# EAGLE design PUSHBUTTON-DEBOUNCE-INTERFACE (EAGLE 6.5.0)
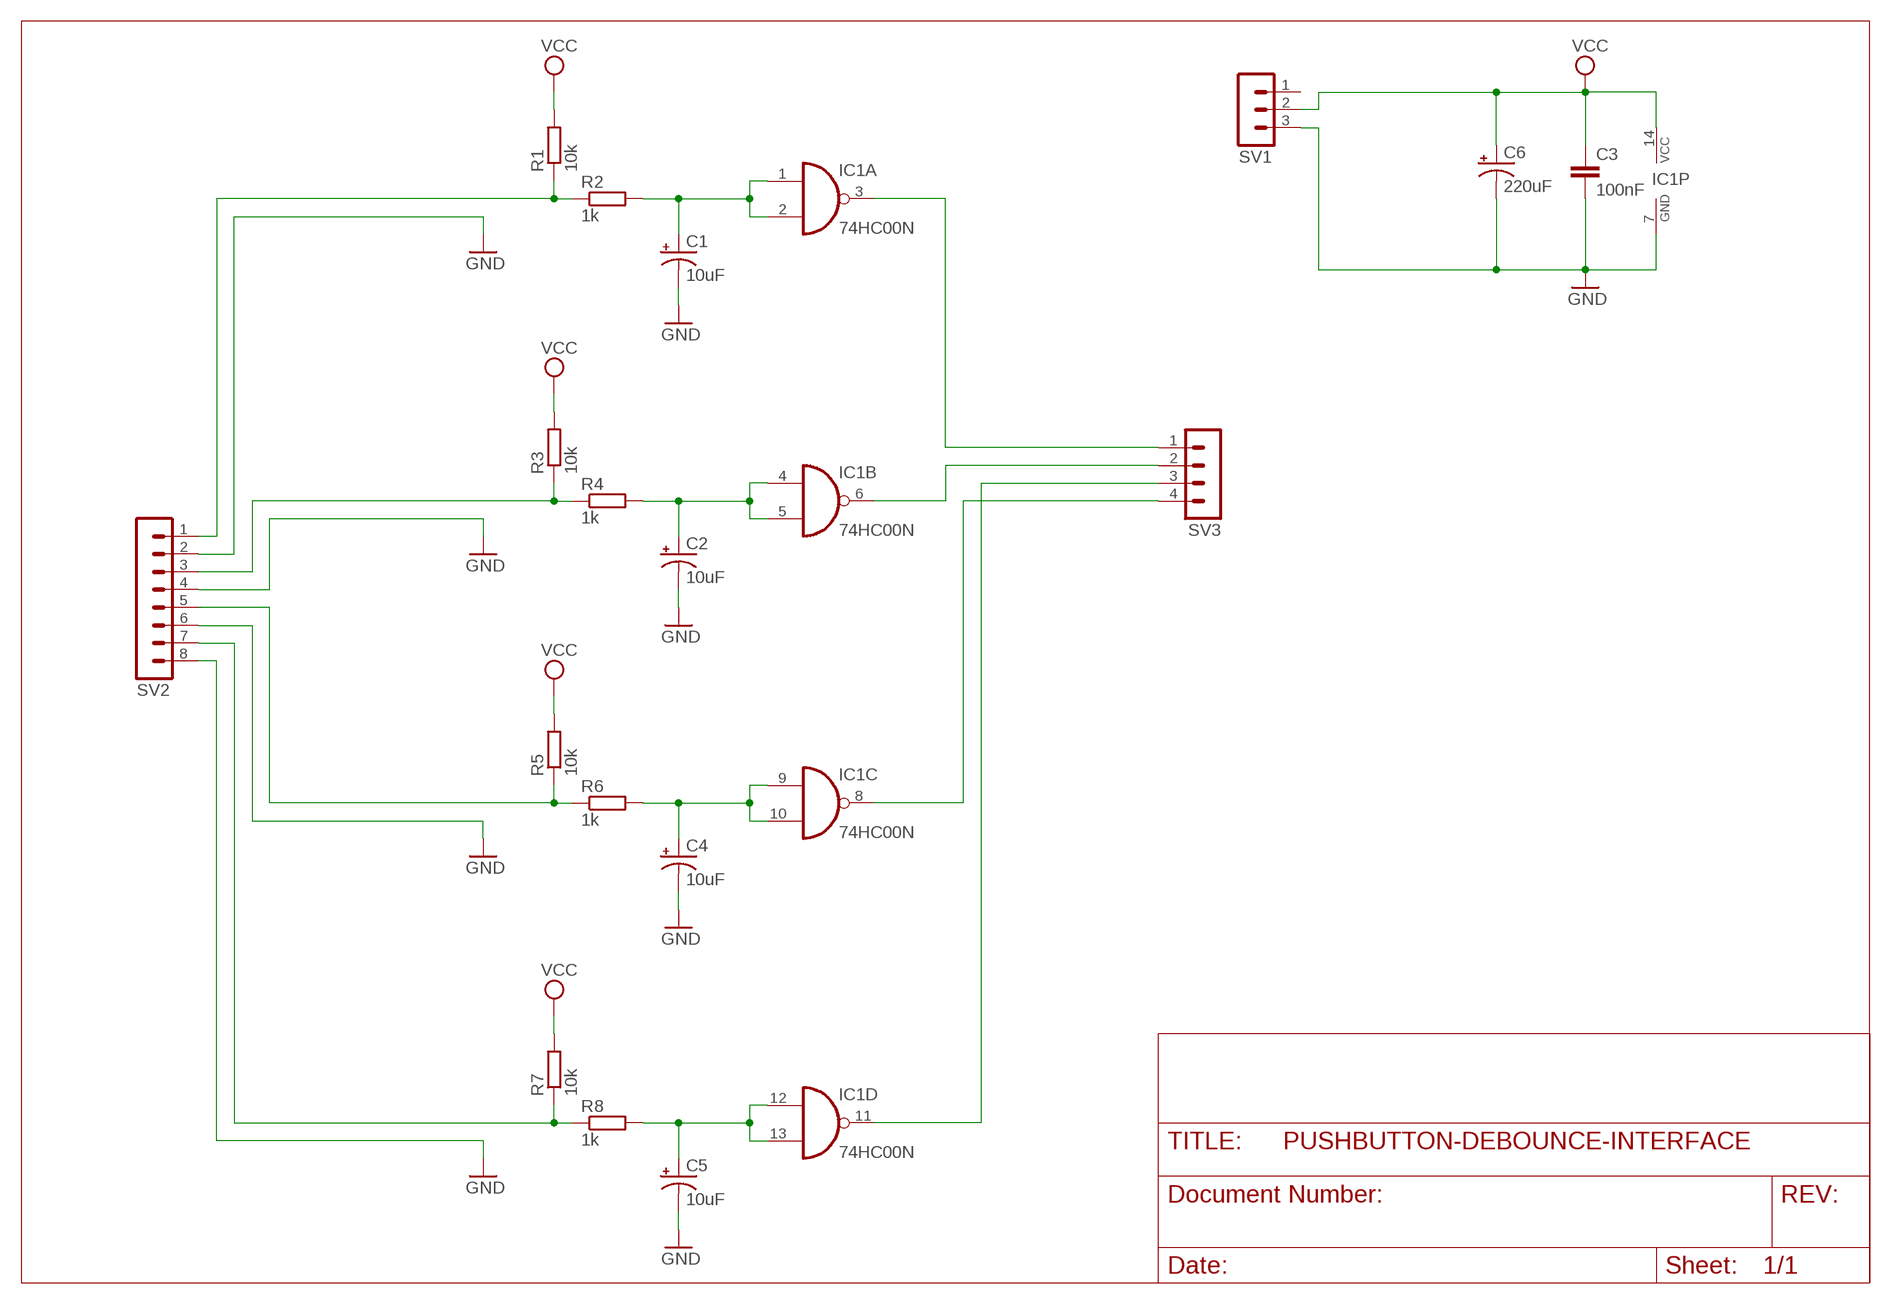
[diagram p0: schematic, sheet 1]

## Parts
C1  10uF  CAP_POLPTH1  [CPOL-RADIAL-100UF-25V]
C2  10uF  CAP_POLPTH1  [CPOL-RADIAL-100UF-25V]
C3  100nF  CAPPTH  [CAP-PTH-SMALL]
C4  10uF  CAP_POLPTH1  [CPOL-RADIAL-100UF-25V]
C5  10uF  CAP_POLPTH1  [CPOL-RADIAL-100UF-25V]
C6  220uF  CAP_POLPTH4  [CPOL-RADIAL-1000UF-25V]
IC1  74HC00N  [DIL14]
R1  10k  R-EU_0207/7  [0207/7]
R2  1k  R-EU_0207/7  [0207/7]
R3  10k  R-EU_0207/12  [0207/12]
R4  1k  R-EU_0207/7  [0207/7]
R5  10k  R-EU_0207/12  [0207/12]
R6  1k  R-EU_0207/7  [0207/7]
R7  10k  R-EU_0207/7  [0207/7]
R8  1k  R-EU_0207/7  [0207/7]
SV1  MA03-1  [MA03-1]
SV2  MA08-1  [MA08-1]
SV3  MA04-1  [MA04-1]

## Nets
GND: C1.2(-) C2.2(-) C3.2 C4.2(-) C5.2(-) C6.2(-) IC1.7(P:GND) SV1.3 SV2.2 SV2.4 SV2.6 SV2.8
N$1: C1.1(+) IC1.1(A:I0) IC1.2(A:I1) R2.2
N$4: C2.1(+) IC1.4(B:I0) IC1.5(B:I1) R4.2
N$6: C4.1(+) IC1.9(C:I0) IC1.10(C:I1) R6.2
N$8: C5.1(+) IC1.12(D:I0) IC1.13(D:I1) R8.2
N$9: IC1.3(A:O) SV3.1
N$10: IC1.6(B:O) SV3.2
N$12: IC1.8(C:O) SV3.4
N$14: IC1.11(D:O) SV3.3
N$15: R1.1 R2.1 SV2.1
N$19: R3.1 R4.1 SV2.3
N$20: R5.1 R6.1 SV2.5
N$21: R7.1 R8.1 SV2.7
VCC: C3.1 C6.1(+) IC1.14(P:VCC) R1.2 R3.2 R5.2 R7.2 SV1.2
Unconnected: SV1.1

## Library data of the parts
C1 C2 C4-C6 = SparkFun-Passives:CAP_POL: Capacitor Polarized These are standard SMD and PTH capacitors. Normally 10uF, 47uF, and 100uF in electrolytic and tantalum varieties. Always verify the external diameter of the through hole cap, it varies with capacity, voltage, and manufacturer. The EIA devices should be standard.
C3 = SparkFun-Capacitors:CAP: Capacitor Standard 0603 ceramic capacitor, and 0.1" leaded capacitor.
IC1 = 74xx-eu:74*00: Quad 2-input NAND gate
R1 R2 R4 R6-R8 = resistor:R-EU_: RESISTOR, European symbol
R3 R5 = rcl:R-EU_: RESISTOR, European symbol
SV1 = con-lstb:MA03-1: PIN HEADER; OC_FARNELL: unknown; OC_NEWARK: unknown
SV2 = con-lstb:MA08-1: PIN HEADER; OC_FARNELL: unknown; OC_NEWARK: unknown
SV3 = con-lstb:MA04-1: PIN HEADER; OC_FARNELL: unknown; OC_NEWARK: unknown

## Board
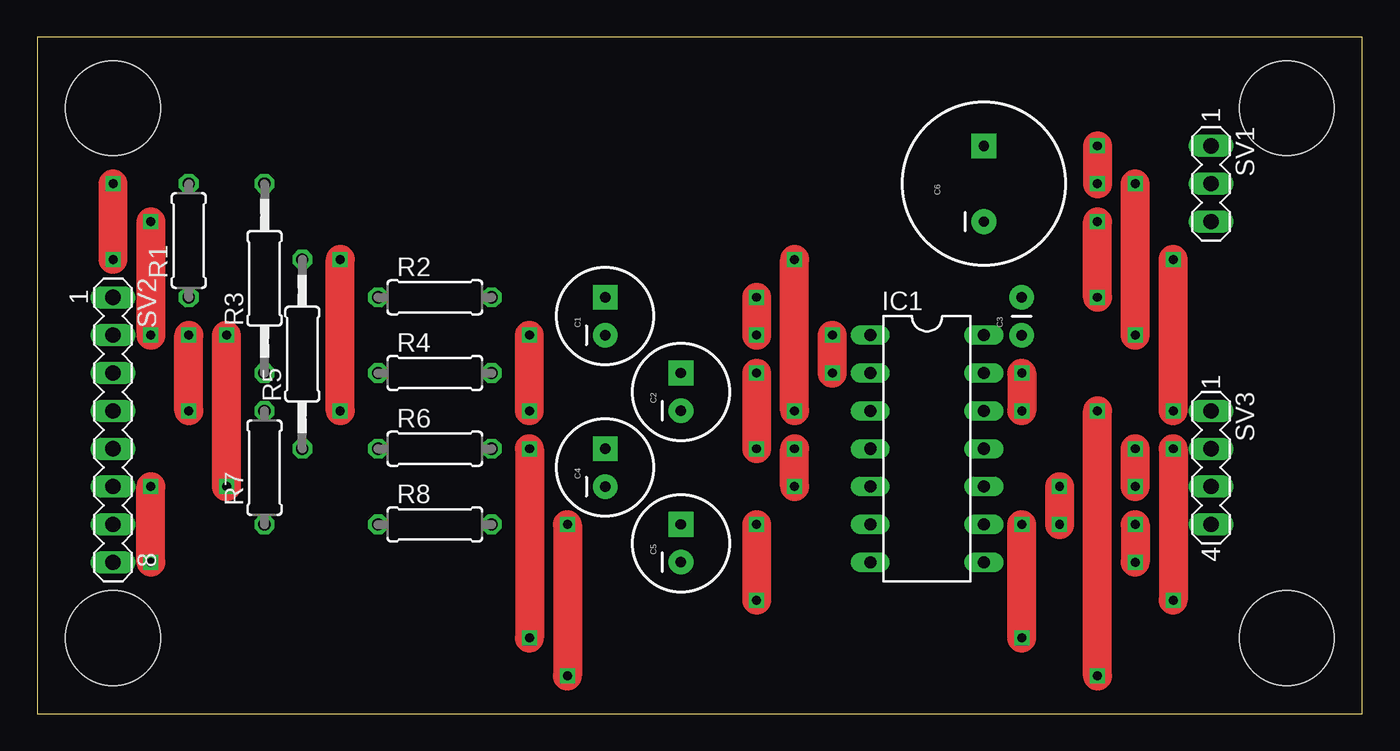
[diagram p1: board, top side]
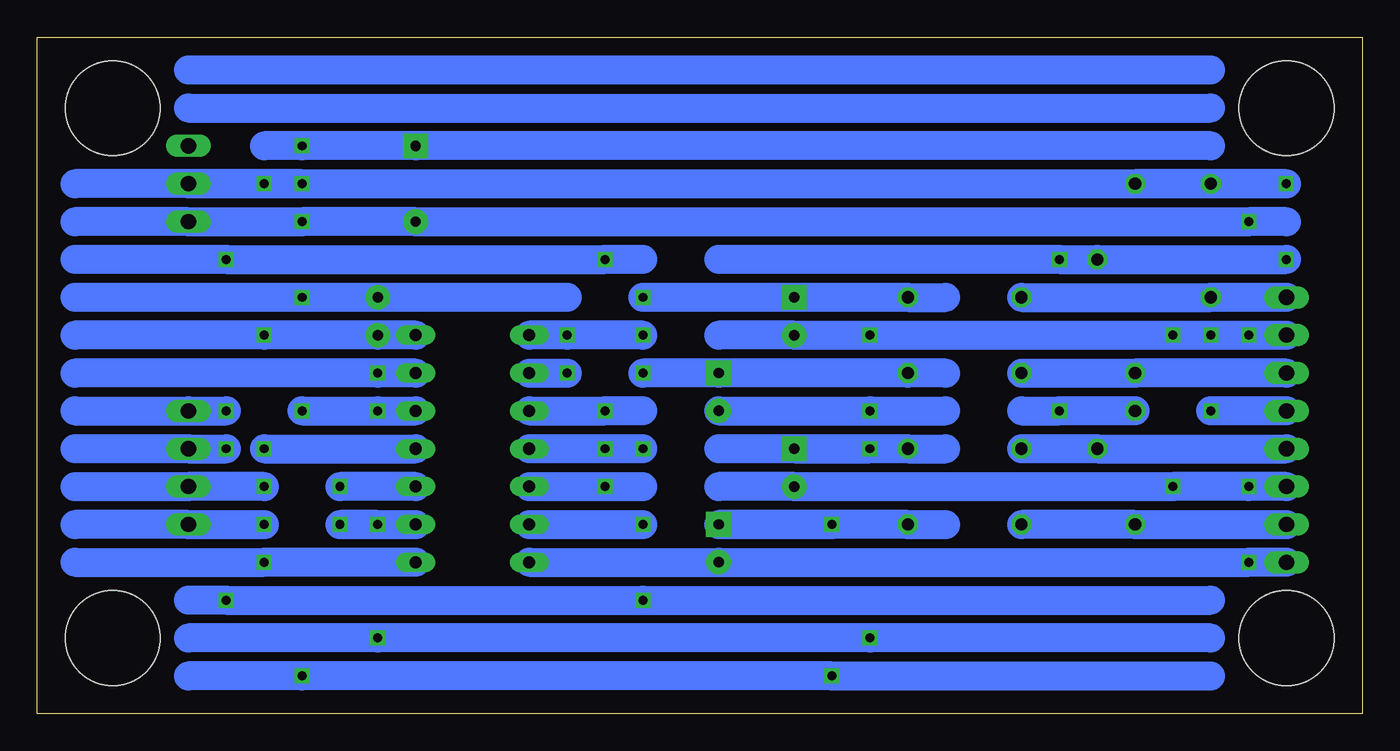
[diagram p2: board, bottom side, seen from below]

Size 88.88 x 45.39 mm. Coordinates in mm from the lower left corner, seen from the top.
Outline: 0,0 88.88,0 88.88,45.39 0,45.39 0,0
Copper layers (1*16): Top 0.035mm / dielectric 1.5mm / Bottom 0.035mm
Design rules "default": minimum track width 10mil, minimum drill 24mil, track to track 8mil, track to pad 8mil, pad to pad 8mil, via to via 8mil, smd to smd 8mil, copper to edge 40mil, drill to drill 8mil, minimum pad ring 10mil, minimum via ring 8mil, stop-mask expansion 4mil, vias tented up to drill 0mil, thermal gap 10mil
Holes 6.35 mm at 5.08,5.08 83.82,5.08 83.82,40.64 5.08,40.64

### Footprints (pad centres in the part's own frame; a part is rotated, then mirrored left to right if it is on the bottom)
CPOL-RADIAL-100UF-25V = drill 0.7 pad 1.651 square: 1 1.27,0 | drill 0.7 pad 1.651: 2 -1.27,0
CAP-PTH-SMALL = drill 0.7 pad 1.651: 1 0,0; 2 2.54,0
CPOL-RADIAL-1000UF-25V = drill 0.7 pad 1.651 square: 1 2.54,0 | drill 0.7 pad 1.651: 2 -2.54,0
DIL14 = drill 0.813 long: 1 -7.62,-3.81; 2 -5.08,-3.81; 3 -2.54,-3.81; 4 0,-3.81; 5 2.54,-3.81; 6 5.08,-3.81; 7 7.62,-3.81; 8 7.62,3.81; 9 5.08,3.81; 10 2.54,3.81; 11 0,3.81; 12 -2.54,3.81; 13 -5.08,3.81; 14 -7.62,3.81
0207/7 = drill 0.813 octagon: 1 -3.81,0; 2 3.81,0
0207/12 = drill 0.813 octagon: 1 -6.35,0; 2 6.35,0
MA03-1 = drill 1.016 long: 1 -2.54,0; 2 0,0; 3 2.54,0
MA08-1 = drill 1.016 long: 1 -8.89,0; 2 -6.35,0; 3 -3.81,0; 4 -1.27,0; 5 1.27,0; 6 3.81,0; 7 6.35,0; 8 8.89,0
MA04-1 = drill 1.016 long: 1 -3.81,0; 2 -1.27,0; 3 1.27,0; 4 3.81,0

### Placement (x,y rotation side)
C1  38.1,26.67 90 top
C2  43.18,21.59 90 top
C3  66.04,25.4 90 top
C4  38.1,16.51 90 top
C5  43.18,11.43 90 top
C6  63.5,35.56 90 top
IC1  59.69,17.78 270 top
R1  10.16,31.75 90 top
R2  26.67,27.94 0 top
R3  15.24,29.21 90 top
R4  26.67,22.86 0 top
R5  17.78,24.13 90 top
R6  26.67,17.78 0 top
R7  15.24,16.51 90 top
R8  26.67,12.7 0 top
SV1  78.74,35.56 270 top
SV2  5.08,19.05 270 top
SV3  78.74,16.51 270 top

### Tracks (layer width: path | path; a pad name or v marks a point on that pad's centre or on a via)
GND  (via drill 0.6)
  Top 1.93: v7.62,33.02 v7.62,25.4 | v12.7,15.24 v12.7,25.4 | v10.16,20.32 v10.16,25.4 | v7.62,10.16 v7.62,15.24 | v33.02,20.32 v33.02,25.4 | v71.12,27.94 v71.12,33.02
  Bottom 1.93: 5.08,33.02 v7.62,33.02 C6.2 v71.12,33.02 SV1.3 86.36,33.02 | v12.7,25.4 SV2.2 | SV2.4 v10.16,20.32 | SV2.6 v12.7,15.24 | v12.7,25.4 v10.16,25.4 v7.62,25.4 | SV2.8 v7.62,10.16 C5.2 IC1.7 | v7.62,15.24 v12.7,15.24 | v12.7,15.24 C4.2 43.18,15.24 | C2.2 v33.02,20.32 27.94,20.32 | v12.7,25.4 v33.02,25.4 C1.2 43.18,25.4 | 53.34,27.94 C3.2 v71.12,27.94 86.36,27.94
N$1  (via drill 0.6)
  Top 1.93: v53.34,22.86 v53.34,25.4 | v48.26,27.94 v48.26,25.4
  Bottom 1.93: IC1.2 v53.34,22.86 | IC1.1 v53.34,25.4 v48.26,25.4 | v48.26,27.94 C1.1 R2.2 27.94,27.94
N$2
  Bottom 1.93: 10.16,38.1 73.66,38.1
N$3
  Bottom 1.93: 78.74,40.64 10.16,40.64
N$4  (via drill 0.6)
  Top 1.93: v50.8,15.24 v50.8,17.78 | v48.26,22.86 v48.26,17.78
  Bottom 1.93: IC1.5 v50.8,15.24 48.26,15.24 | IC1.4 v50.8,17.78 v48.26,17.78 | v48.26,22.86 C2.1 R4.2 27.94,22.86
N$5
  Bottom 1.93: 10.16,43.18 78.74,43.18
N$6  (via drill 0.6)
  Top 1.93: v68.58,15.24 v68.58,12.7 | v33.02,17.78 v33.02,5.08 | v66.04,5.08 v66.04,12.7
  Bottom 1.93: C4.1 R6.2 27.94,17.78 | IC1.10 v68.58,15.24 | IC1.9 v68.58,12.7 v66.04,12.7 | C4.1 v33.02,17.78 | C4.1 43.18,17.78 | 10.16,5.08 v33.02,5.08 v66.04,5.08 78.74,5.08
N$8  (via drill 0.6)
  Top 1.93: v66.04,22.86 v66.04,20.32 | v35.56,12.7 v35.56,2.54 | v71.12,2.54 v71.12,20.32
  Bottom 1.93: IC1.13 v66.04,22.86 86.36,22.86 | IC1.12 v66.04,20.32 v71.12,20.32 | v35.56,12.7 C5.1 R8.2 27.94,12.7 | 10.16,2.54 v35.56,2.54 v71.12,2.54 78.74,2.54
N$9  (via drill 0.6)
  Top 1.93: v50.8,20.32 v50.8,30.48 | v76.2,20.32 v76.2,30.48
  Bottom 1.93: IC1.3 v50.8,20.32 48.26,20.32 | v76.2,20.32 SV3.1 86.36,20.32 | 86.36,30.48 v76.2,30.48 v50.8,30.48 48.26,30.48
N$10  (via drill 0.6)
  Top 1.93: v48.26,12.7 v48.26,7.62 | v76.2,17.78 v76.2,7.62
  Bottom 1.93: IC1.6 v48.26,12.7 | v76.2,17.78 SV3.2 86.36,17.78 | 10.16,7.62 v48.26,7.62 v76.2,7.62 78.74,7.62
N$12  (via drill 0.6)
  Top 1.93: v73.66,12.7 v73.66,10.16
  Bottom 1.93: IC1.8 v73.66,10.16 86.36,10.16 | v73.66,12.7 SV3.4 86.36,12.7
N$14  (via drill 0.6)
  Top 1.93: v73.66,15.24 v73.66,17.78
  Bottom 1.93: v73.66,17.78 IC1.11 | v73.66,15.24 SV3.3 86.36,15.24
N$15
  Bottom 1.93: SV2.1 R1.1 R2.1
N$19
  Bottom 1.93: SV2.3 R3.1 R4.1
N$20
  Bottom 1.93: SV2.5 R5.1 R6.1
N$21
  Bottom 1.93: SV2.7 R7.1 R8.1
VCC  (via drill 0.6)
  Top 1.93: v5.08,30.48 v5.08,35.56 | v20.32,20.32 v20.32,30.48 | v73.66,25.4 v73.66,35.56 | v71.12,38.1 v71.12,35.56
  Bottom 1.93: SV1.2 v73.66,35.56 v71.12,35.56 | v71.12,35.56 v5.08,35.56 | v5.08,35.56 R1.2 R3.2 v5.08,35.56 | v5.08,30.48 R5.2 v20.32,30.48 43.18,30.48 | R7.2 v20.32,20.32 22.86,20.32 | C3.1 IC1.14 v73.66,25.4 86.36,25.4 | SV1.2 86.36,35.56 | C6.1 v71.12,38.1 | v71.12,35.56 SV1.2